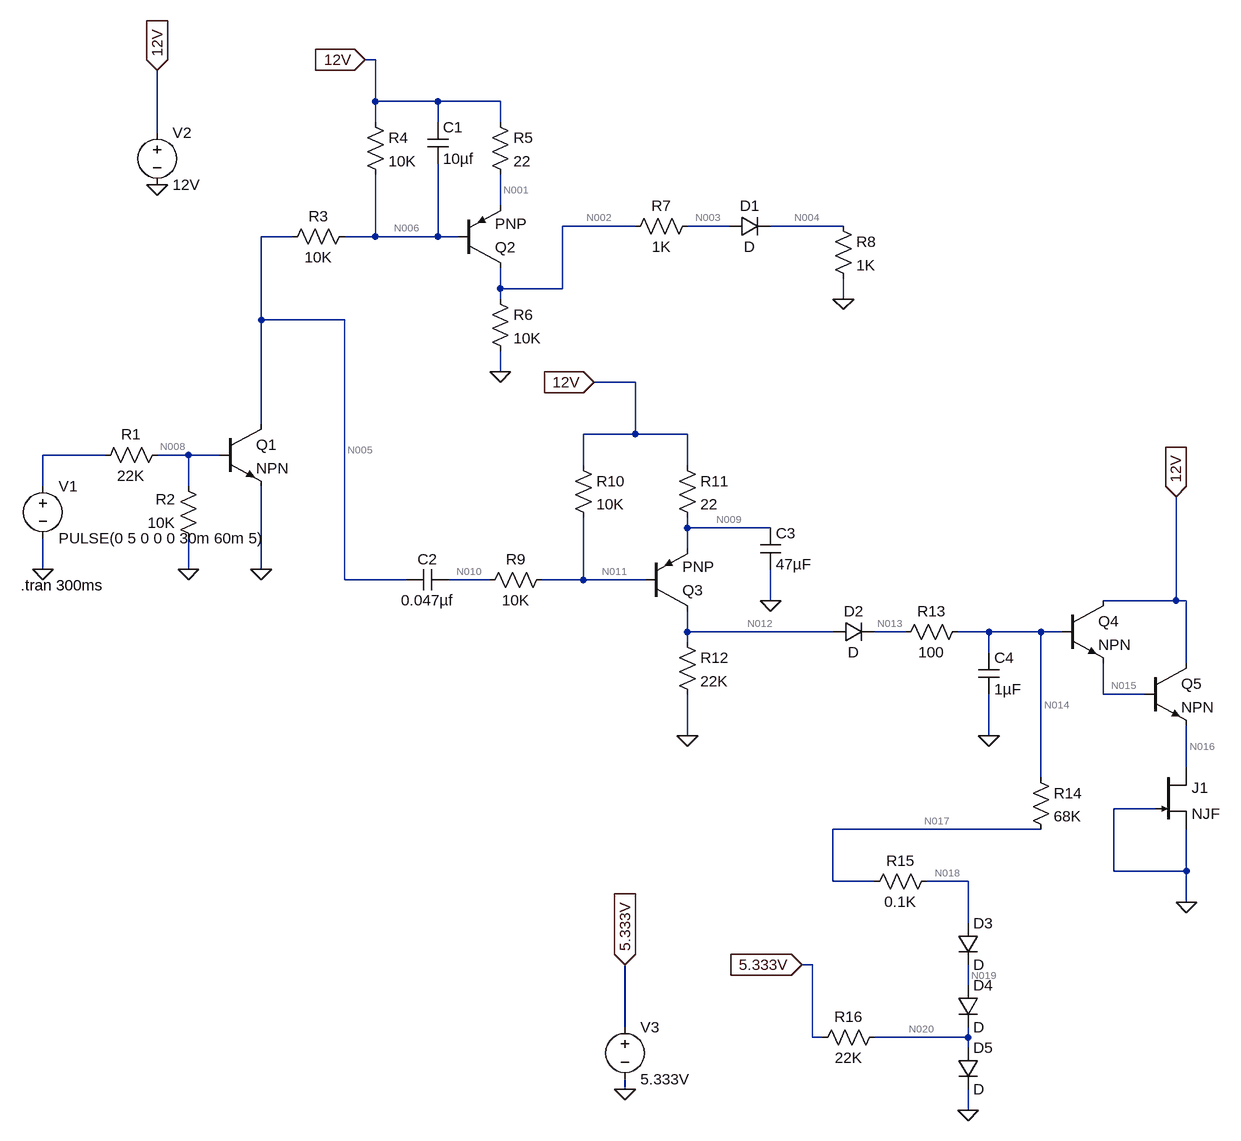
[diagram p0: schematic Gate_Env1.asc]
Gate_Env1.asc, the LTspice schematic file:
Version 4
SHEET 1 1696 1188
WIRE 384 -448 368 -448
WIRE 384 -384 384 -448
WIRE 480 -384 384 -384
WIRE 576 -384 480 -384
WIRE 384 -352 384 -384
WIRE 480 -352 480 -384
WIRE 576 -352 576 -384
WIRE 48 -336 48 -432
WIRE 576 -224 576 -272
WIRE 784 -192 672 -192
WIRE 928 -192 864 -192
WIRE 1104 -192 992 -192
WIRE 256 -176 208 -176
WIRE 384 -176 384 -272
WIRE 384 -176 336 -176
WIRE 480 -176 480 -288
WIRE 480 -176 384 -176
WIRE 512 -176 480 -176
WIRE 576 -96 576 -128
WIRE 672 -96 672 -192
WIRE 672 -96 576 -96
WIRE 576 -80 576 -96
WIRE 1104 -80 1104 -112
WIRE 208 -48 208 -176
WIRE 336 -48 208 -48
WIRE 576 32 576 0
WIRE 784 48 720 48
WIRE 208 112 208 -48
WIRE 784 128 784 48
WIRE 784 128 704 128
WIRE 864 128 784 128
WIRE -32 160 -128 160
WIRE 96 160 48 160
WIRE 144 160 96 160
WIRE 704 176 704 128
WIRE 864 176 864 128
WIRE -128 208 -128 160
WIRE 96 208 96 160
WIRE 864 272 864 256
WIRE 992 272 864 272
WIRE 864 304 864 272
WIRE -128 336 -128 288
WIRE 96 336 96 288
WIRE 208 336 208 208
WIRE 336 352 336 -48
WIRE 432 352 336 352
WIRE 560 352 496 352
WIRE 704 352 704 256
WIRE 704 352 640 352
WIRE 800 352 704 352
WIRE 992 384 992 336
WIRE 1616 384 1616 224
WIRE 1616 384 1504 384
WIRE 1632 384 1616 384
WIRE 864 432 864 400
WIRE 1088 432 864 432
WIRE 1200 432 1152 432
WIRE 1328 432 1280 432
WIRE 1408 432 1328 432
WIRE 1440 432 1408 432
WIRE 864 448 864 432
WIRE 1328 464 1328 432
WIRE 1632 480 1632 384
WIRE 1504 528 1504 480
WIRE 1568 528 1504 528
WIRE 864 592 864 528
WIRE 1328 592 1328 528
WIRE 1632 640 1632 576
WIRE 1408 656 1408 432
WIRE 1584 704 1520 704
WIRE 1408 736 1088 736
WIRE 1520 800 1520 704
WIRE 1632 800 1632 736
WIRE 1632 800 1520 800
WIRE 1088 816 1088 736
WIRE 1152 816 1088 816
WIRE 1296 816 1232 816
WIRE 1632 848 1632 800
WIRE 1296 880 1296 816
WIRE 1056 944 1040 944
WIRE 1296 976 1296 944
WIRE 768 1040 768 944
WIRE 1056 1056 1056 944
WIRE 1072 1056 1056 1056
WIRE 1296 1056 1296 1040
WIRE 1296 1056 1152 1056
WIRE 1296 1072 1296 1056
WIRE 768 1136 768 1120
WIRE 1296 1168 1296 1136
FLAG 208 336 0
FLAG 96 336 0
FLAG -128 336 0
FLAG 576 32 0
FLAG 48 -256 0
FLAG 48 -432 12V
IOPIN 48 -432 In
FLAG 368 -448 12V
IOPIN 368 -448 In
FLAG 1104 -80 0
FLAG 864 592 0
FLAG 720 48 12V
IOPIN 720 48 In
FLAG 992 384 0
FLAG 1328 592 0
FLAG 1616 224 12V
IOPIN 1616 224 In
FLAG 1632 848 0
FLAG 1296 1168 0
FLAG 768 1136 0
FLAG 768 944 5.333V
IOPIN 768 944 In
FLAG 1040 944 5.333V
IOPIN 1040 944 In
SYMBOL npn 144 112 R0
SYMATTR InstName Q1
SYMBOL res 64 144 R90
WINDOW 0 0 56 VBottom 2
WINDOW 3 32 56 VTop 2
SYMATTR InstName R1
SYMATTR Value 22K
SYMBOL res 112 304 R180
WINDOW 0 36 76 Left 2
WINDOW 3 36 40 Left 2
SYMATTR InstName R2
SYMATTR Value 10K
SYMBOL voltage -128 192 R0
WINDOW 123 0 0 Left 0
WINDOW 39 0 0 Left 0
SYMATTR InstName V1
SYMATTR Value PULSE(0 5 0 0 0 30m 60m 5)
SYMBOL res 352 -192 R90
WINDOW 0 0 56 VBottom 2
WINDOW 3 32 56 VTop 2
SYMATTR InstName R3
SYMATTR Value 10K
SYMBOL res 368 -368 R0
SYMATTR InstName R4
SYMATTR Value 10K
SYMBOL res 560 -368 R0
SYMATTR InstName R5
SYMATTR Value 22
SYMBOL res 560 -96 R0
SYMATTR InstName R6
SYMATTR Value 10K
SYMBOL pnp 512 -128 M180
SYMATTR InstName Q2
SYMBOL cap 464 -352 R0
SYMATTR InstName C1
SYMATTR Value 10µf
SYMATTR SpiceLine V=16V
SYMBOL voltage 48 -352 R0
WINDOW 123 0 0 Left 0
WINDOW 39 0 0 Left 0
SYMATTR InstName V2
SYMATTR Value 12V
SYMBOL res 880 -208 R90
WINDOW 0 0 56 VBottom 2
WINDOW 3 32 56 VTop 2
SYMATTR InstName R7
SYMATTR Value 1K
SYMBOL diode 928 -176 R270
WINDOW 0 32 32 VTop 2
WINDOW 3 0 32 VBottom 2
SYMATTR InstName D1
SYMBOL res 1088 -208 R0
SYMATTR InstName R8
SYMATTR Value 1K
SYMBOL cap 432 368 R270
WINDOW 0 32 32 VTop 2
WINDOW 3 0 32 VBottom 2
SYMATTR InstName C2
SYMATTR Value 0.047µf
SYMBOL res 656 336 R90
WINDOW 0 0 56 VBottom 2
WINDOW 3 32 56 VTop 2
SYMATTR InstName R9
SYMATTR Value 10K
SYMBOL res 688 160 R0
SYMATTR InstName R10
SYMATTR Value 10K
SYMBOL res 848 160 R0
SYMATTR InstName R11
SYMATTR Value 22
SYMBOL cap 976 272 R0
SYMATTR InstName C3
SYMATTR Value 47µF
SYMBOL pnp 800 400 M180
SYMATTR InstName Q3
SYMBOL res 848 432 R0
SYMATTR InstName R12
SYMATTR Value 22K
SYMBOL diode 1088 448 R270
WINDOW 0 32 32 VTop 2
WINDOW 3 0 32 VBottom 2
SYMATTR InstName D2
SYMBOL res 1296 416 R90
WINDOW 0 0 56 VBottom 2
WINDOW 3 32 56 VTop 2
SYMATTR InstName R13
SYMATTR Value 100
SYMBOL cap 1312 464 R0
SYMATTR InstName C4
SYMATTR Value 1µF
SYMBOL npn 1440 384 R0
SYMATTR InstName Q4
SYMBOL npn 1568 480 R0
SYMATTR InstName Q5
SYMBOL njf 1584 640 R0
SYMATTR InstName J1
SYMBOL res 1392 640 R0
SYMATTR InstName R14
SYMATTR Value 68K
SYMBOL res 1248 800 R90
WINDOW 0 0 56 VBottom 2
WINDOW 3 32 56 VTop 2
SYMATTR InstName R15
SYMATTR Value 0.1K
SYMBOL diode 1280 880 R0
SYMATTR InstName D3
SYMBOL diode 1280 976 R0
SYMATTR InstName D4
SYMBOL diode 1280 1072 R0
SYMATTR InstName D5
SYMBOL voltage 768 1024 R0
WINDOW 123 0 0 Left 0
WINDOW 39 0 0 Left 0
SYMATTR InstName V3
SYMATTR Value 5.333V
SYMBOL res 1168 1040 R90
WINDOW 0 0 56 VBottom 2
WINDOW 3 32 56 VTop 2
SYMATTR InstName R16
SYMATTR Value 22K
TEXT -162 360 Left 2 !.tran 300ms

The netlist it stands for:
* Gate_Env1.asc
Q1 N005 N008 0 0 NPN
R1 N008 N007 22K
R2 0 N008 10K
V1 N007 0 PULSE(0 5 0 0 0 30m 60m 5)
R3 N006 N005 10K
R4 12V N006 10K
R5 12V N001 22
R6 N002 0 10K
Q2 N002 N006 N001 0 PNP
C1 12V N006 10µf V=16V
V2 12V 0 12V
R7 N003 N002 1K
D1 N003 N004 D
R8 N004 0 1K
C2 N005 N010 0.047µf
R9 N011 N010 10K
R10 12V N011 10K
R11 12V N009 22
C3 N009 0 47µF
Q3 N012 N011 N009 0 PNP
R12 N012 0 22K
D2 N012 N013 D
R13 N014 N013 100
C4 N014 0 1µF
Q4 12V N014 N015 0 NPN
Q5 12V N015 N016 0 NPN
J1 N016 0 0 NJF
R14 N014 N017 68K
R15 N018 N017 0.1K
D3 N018 N019 D
D4 N019 N020 D
D5 N020 0 D
V3 5.333V 0 5.333V
R16 N020 5.333V 22K
.model D D
.lib standard.dio
.model NPN NPN
.model PNP PNP
.lib standard.bjt
.model NJF NJF
.model PJF PJF
.lib standard.jft
.tran 300ms
.backanno
.end

* Results of the author's LTspice run, read from the files saved beside the schematic
* Operating Point, zero values left out:
*   V(n005) = 12 V
*   V(n008) = 82.5 nV
*   V(n006) = 12 V
*   V(12v) = 12 V
*   V(n001) = 12 V
*   V(n002) = 120 nV
*   V(n003) = 120 nV
*   V(n010) = 12 V
*   V(n011) = 12 V
*   V(n009) = 12 V
*   V(n012) = 284.6 nV
*   V(n013) = 924.4 mV
*   V(n014) = 924.4 mV
*   V(n015) = 522.2 mV
*   V(n016) = 147.2 µV
*   V(n017) = 924.4 mV
*   V(n018) = 924.4 mV
*   V(n019) = 769.8 mV
*   V(n020) = 615.3 mV
*   V(5.333v) = 5.333 V
*   Ic(Q3) = -12 pA
*   Ib(Q3) = 12 pA
*   Ic(Q2) = -12 pA
*   Ib(Q2) = 12 pA
*   Ic(Q5) = 58.32 nA
*   Ib(Q5) = 572.1 pA
*   Ie(Q5) = -58.89 nA
*   Ic(Q4) = 577.1 pA
*   Ib(Q4) = -5.013 pA
*   Ie(Q4) = -572.1 pA
*   Ic(Q1) = 12 pA
*   Ib(Q1) = -12 pA
*   I(D5) = 214.4 µA
*   I(D4) = 4.079 pA
*   I(D3) = 4.079 pA
*   Id(J1) = 58.89 nA
*   Is(J1) = -58.89 nA
*   I(R16) = -214.4 µA
*   I(R15) = -4.079 pA
*   I(R14) = 4.079 pA
*   I(R12) = 12.93 pA
*   I(R10) = 12 pA
*   I(R6) = 12 pA
*   I(R4) = 24 pA
*   I(R3) = 12 pA
*   I(R2) = -8.25 pA
*   I(R1) = 3.75 pA
*   I(V3) = -214.4 µA
*   I(V2) = -58.93 nA
*   I(V1) = 3.75 pA
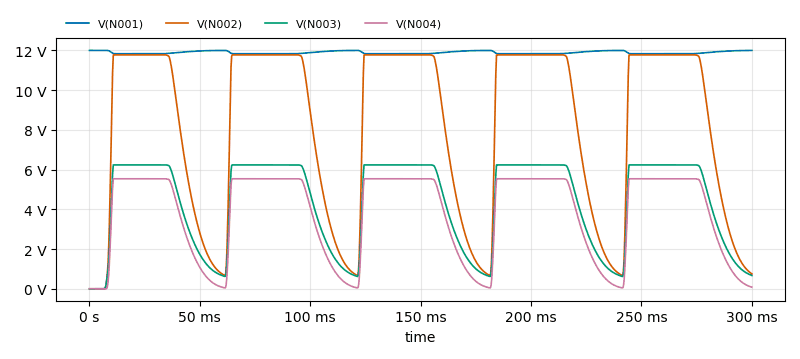
[diagram p1: Transient Analysis of Gate_Env1.asc, plotted from the saved traces]
* Transient Analysis, 1 run:
*   V(N001): min 11.83 V, max 12 V, average 11.89 V, rms 11.89 V, last 12 V
*   V(N002): min 0 V, max 11.77 V, average 8.087 V, rms 9.242 V, last 751 mV
*   V(N003): min 0 V, max 6.236 V, average 4.374 V, rms 4.927 V, last 670.5 mV
*   V(N004): min 0 V, max 5.537 V, average 3.713 V, rms 4.32 V, last 80.5 mV